# Altium schematic sheet oscillator_reannotated.SchDoc
size A4; SheetNumber: 1; SheetTotal: 1; SPICEModelCacheCSPBSJPQ: <root> / <DocumentId>CSPBSJPQ</DocumentId> / <CacheFrame Number="0"> / <Model Name="bc846" Kind="MDL"> / <Text>.MODEL BC846 NPN(  BF=324.4 BR=8.29 CJC=3.347E-12 CJE=1.244E-11 FC=0.979 IKF=0.109 IKR=0.09 IRB=5E-06 IS=1.822E-14 ISC=9.982E-12 ISE=2.894E-16 ITF=0.3131 MJC=0.391 MJE=0.3656 MJS=0.333 NC=1.763 NE=1.4 NF=0.9932 NK=500M NR=0.9931 RB=10 RBM=5 RC=0.7014 RE=0.649 TF=4.908E-10 TR=9E-08 VAF=82 VAR=17.9 VJC=0.5463 VJE=0.7579 VTF=2.927 XCJC=0.6193 XTF=9.51 )</Text> / </Model> / </CacheFrame> / </root>
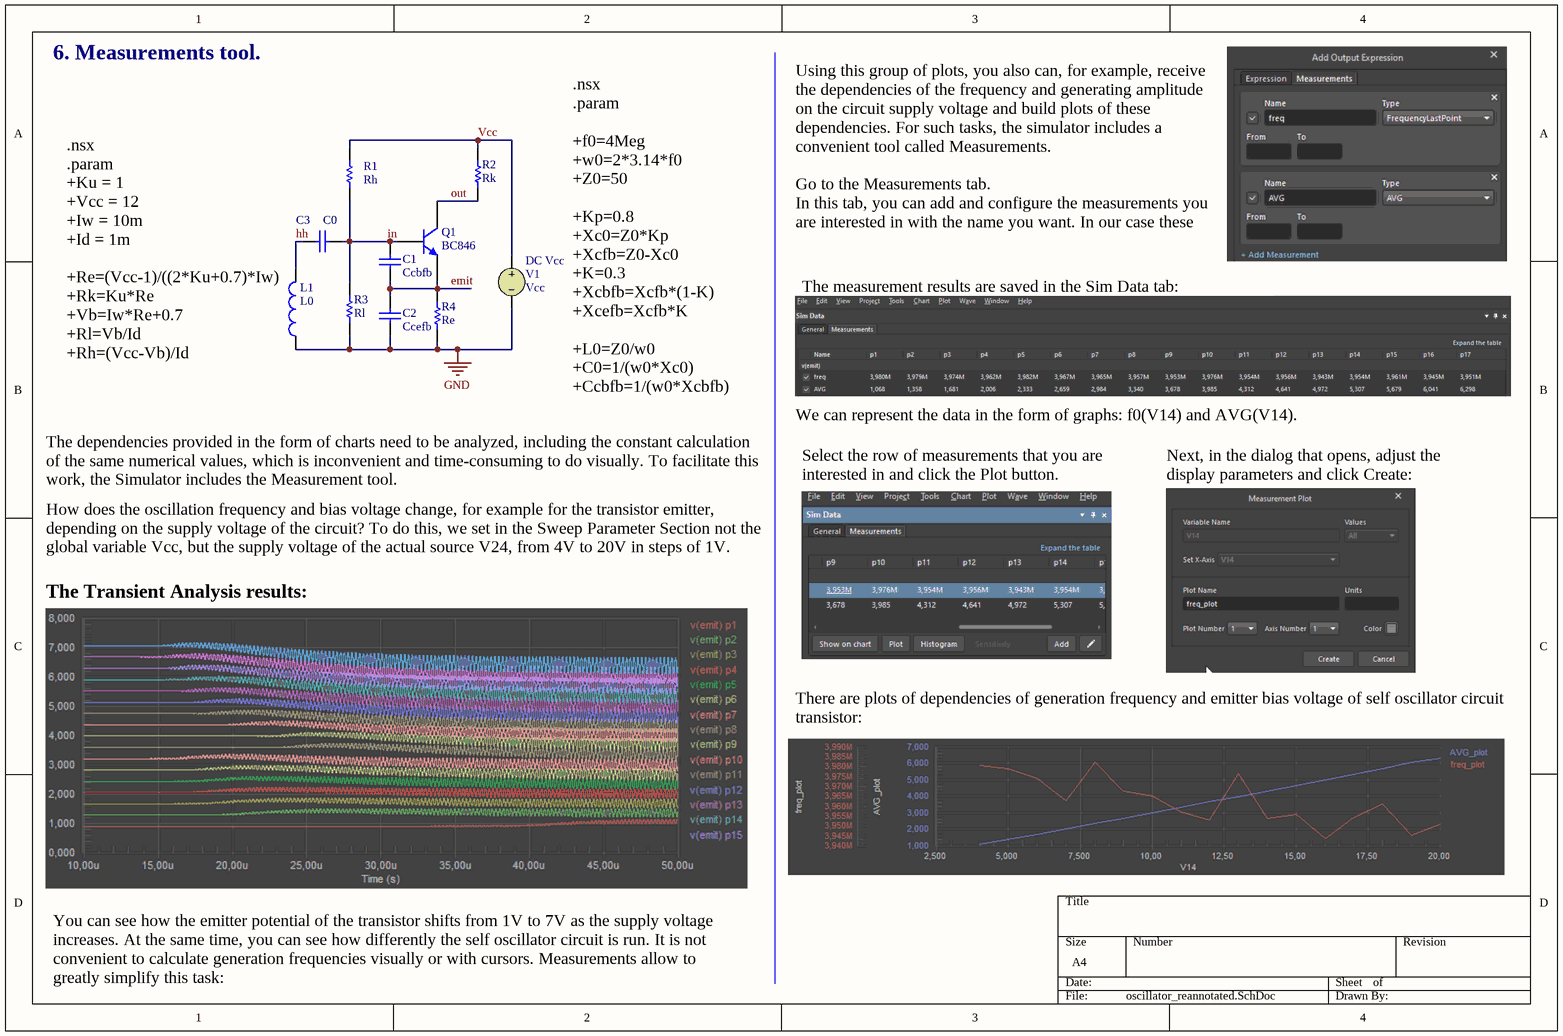
[diagram p0: oscillator_reannotated.SchDoc]

## Parts
C1  value Ccbfb  (hidden comment: Capacitor)
C2  value Ccefb  (hidden comment: Capacitor)
C3  value C0  (hidden comment: Capacitor)
L1  value L0  (hidden comment: Inductor)
Q1  BC846  [TO-92A]
R1  value Rh  (hidden comment: Resistor)
R2  value Rk  (hidden comment: Resistor)
R3  value Rl  (hidden comment: Resistor)
R4  value Re  (hidden comment: Resistor)
V1  DC Vcc  value Vcc

## Nets
GND: C2.1 L1.1 R3.2 R4.1 V1.2
emit: C1.1 C2.2 Q1.1(E) R4.2
hh: C3.1 L1.2
in: C1.2 C3.2 Q1.2(B) R1.1 R3.1
out: Q1.3(C) R2.1
Vcc: R1.2 R2.2 V1.1

## Notes on the sheet
- 6. Measurements tool.
- Using this group of plots, you also can, for example, receive the dependencies of the frequency and generating amplitude on the circuit supply voltage and build plots of these dependencies. For such tasks, the simulator includes a convenient tool called Measurements.
  Go to the Measurements tab.
  In this tab, you can add and configure the measurements you are interested in with the name you want. In our case these are: FrequenciLastPoint and AVG:
- The measurement results are saved in the Sim Data tab:
- (near L1) .nsx
  .param
  +Ku = 1
  +Vcc = 12
  +Iw = 10m
  +Id = 1m
  +Re=(Vcc-1)/((2*Ku+0.7)*Iw)
  +Rk=Ku*Re
  +Vb=Iw*Re+0.7
  +Rl=Vb/Id
  +Rh=(Vcc-Vb)/Id
- .nsx
  .param
  +f0=4Meg
  +w0=2*3.14*f0
  +Z0=50
  +Kp=0.8
  +Xc0=Z0*Kp
  +Xcfb=Z0-Xc0
  +K=0.3
  +Xcbfb=Xcfb*(1-K)
  +Xcefb=Xcfb*K
  +L0=Z0/w0
  +C0=1/(w0*Xc0)
  +Ccbfb=1/(w0*Xcbfb)
  +Ccefb=1/(w0*Xcefb)
- We can represent the data in the form of graphs: f0(V14) and AVG(V14).
- The dependencies provided in the form of charts need to be analyzed, including the constant calculation of the same numerical values, which is inconvenient and time-consuming to do visually. To facilitate this work, the Simulator includes the Measurement tool.
- Select the row of measurements that you are interested in and click the Plot button.
- Next, in the dialog that opens, adjust the display parameters and click Create:
- How does the oscillation frequency and bias voltage change, for example for the transistor emitter, depending on the supply voltage of the circuit? To do this, we set in the Sweep Parameter Section not the global variable Vcc, but the supply voltage of the actual source V24, from 4V to 20V in steps of 1V.
- The Transient Analysis results:
- There are plots of dependencies of generation frequency and emitter bias voltage of self oscillator circuit transistor:
- You can see how the emitter potential of the transistor shifts from 1V to 7V as the supply voltage increases. At the same time, you can see how differently the self oscillator circuit is run. It is not convenient to calculate generation frequencies visually or with cursors. Measurements allow to greatly simplify this task:

## Library data of the parts
C1-C3 = Capacitor: SimulationGenericComponent: True
L1 = Inductor: SimulationGenericComponent: True
Q1 = 2N3904: NPN General Purpose Amplifier; Published: 8-Jun-2000; LatestRevisionDate: 15-Jan-2003; LatestRevisionNote: PCB Footprint 'BCY-W3/D4.7' replaced; DatasheetVersion: 1997; PackageVersion: Sep-1998; PackageReference: TO-92A; Publisher: Altium Limited; PackageDescription: TO, Flat Index; 3 In-Line, Axial Leads; Body Dia. 4.5mm; Leads 0.51 x 0.48 mm (max); ComponentLink1Description: Manufacturer Link; ComponentLink1URL: http://www.fairchildsemi.com/; ComponentLink2Description: Datasheet; ComponentLink2URL: http://www.fairchildsemi.com/ds/2N%2F2N3904.pdf
V1 = VSRC: Voltage Source; Note: PCB Footprint - Not required; AC Magnitude: 0; Published: 30-July-2020; LatestRevisionDate: 30-July-2020; LatestRevisionNote: Re-released for DXP Platform.; PackageReference: Not Applicable; Publisher: Altium Limited